# Altium schematic sheet Sender_Top.SchDoc
size A4
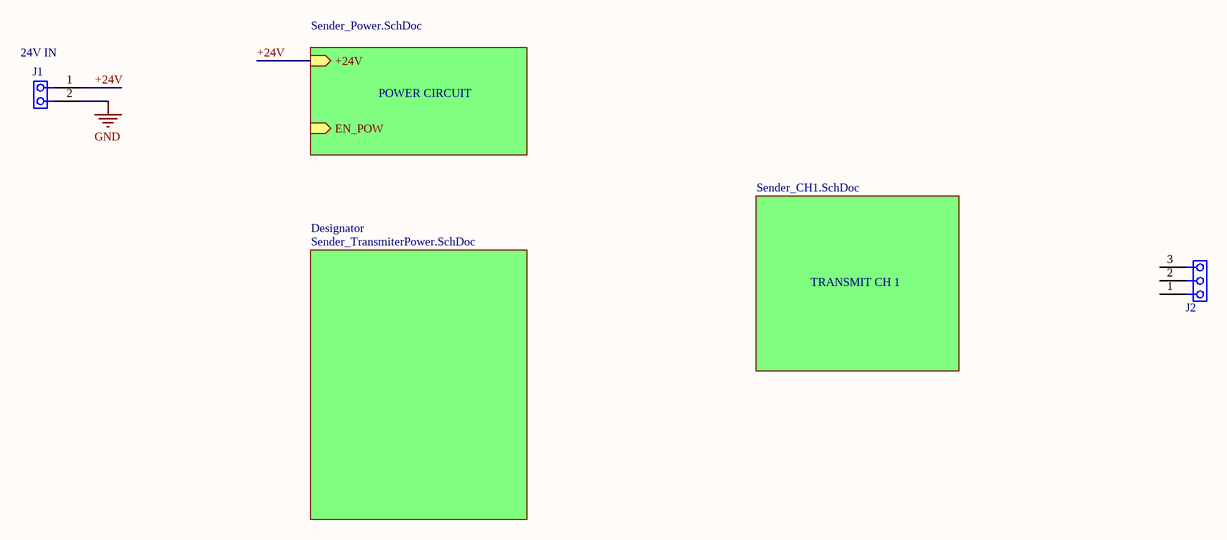
[diagram p0: Sender_Top.SchDoc]

## Parts
J1  24V IN  [WAGO_2_pins]
J2  CONN 3x1  [WAGO-3_pins]  (value not drawn)

## Sub-sheets
Designator = Sender_TransmiterPower.SchDoc: no entries
POWER CIRCUIT = Sender_Power.SchDoc: +24V (in), EN_POW (in)
TRANSMIT CH 1 = Sender_CH1.SchDoc: no entries

## Nets
GND: J1.2(Vout)
+24V: J1.1(Vout) ; sheet POWER CIRCUIT/+24V

Not connected (* = marked no-connect by the designer): J2 1(Vout) 2(Vout) 3(Vout)

## Library data of the parts
J1 = 2x1 connector
J2 = 3x1 connector